# Altium schematic sheet QI9-2604-A01.SchDoc
size D; SheetNumber: 1; SheetTotal: 1
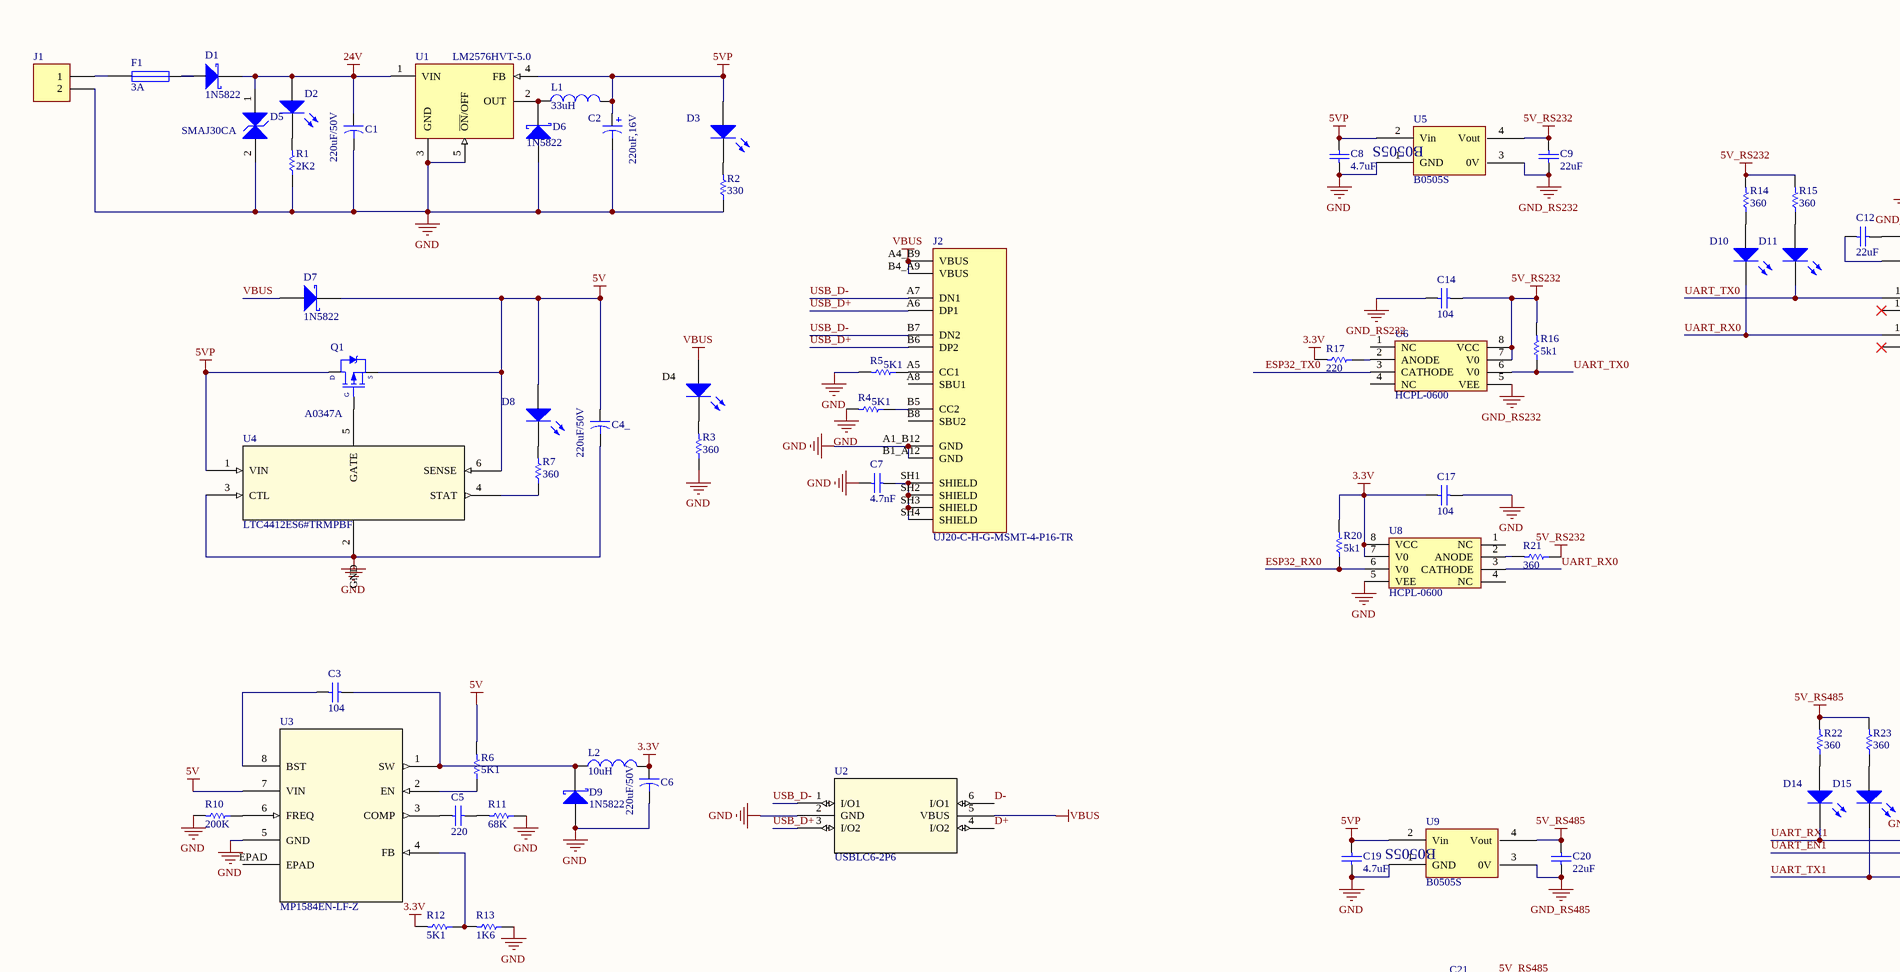
[diagram p0: QI9-2604-A01.SchDoc, top left]
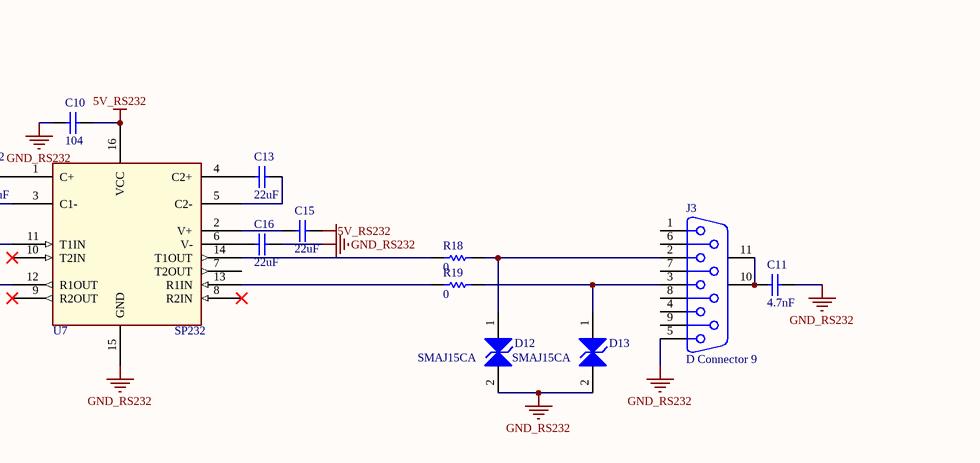
[diagram p1: QI9-2604-A01.SchDoc, top right]
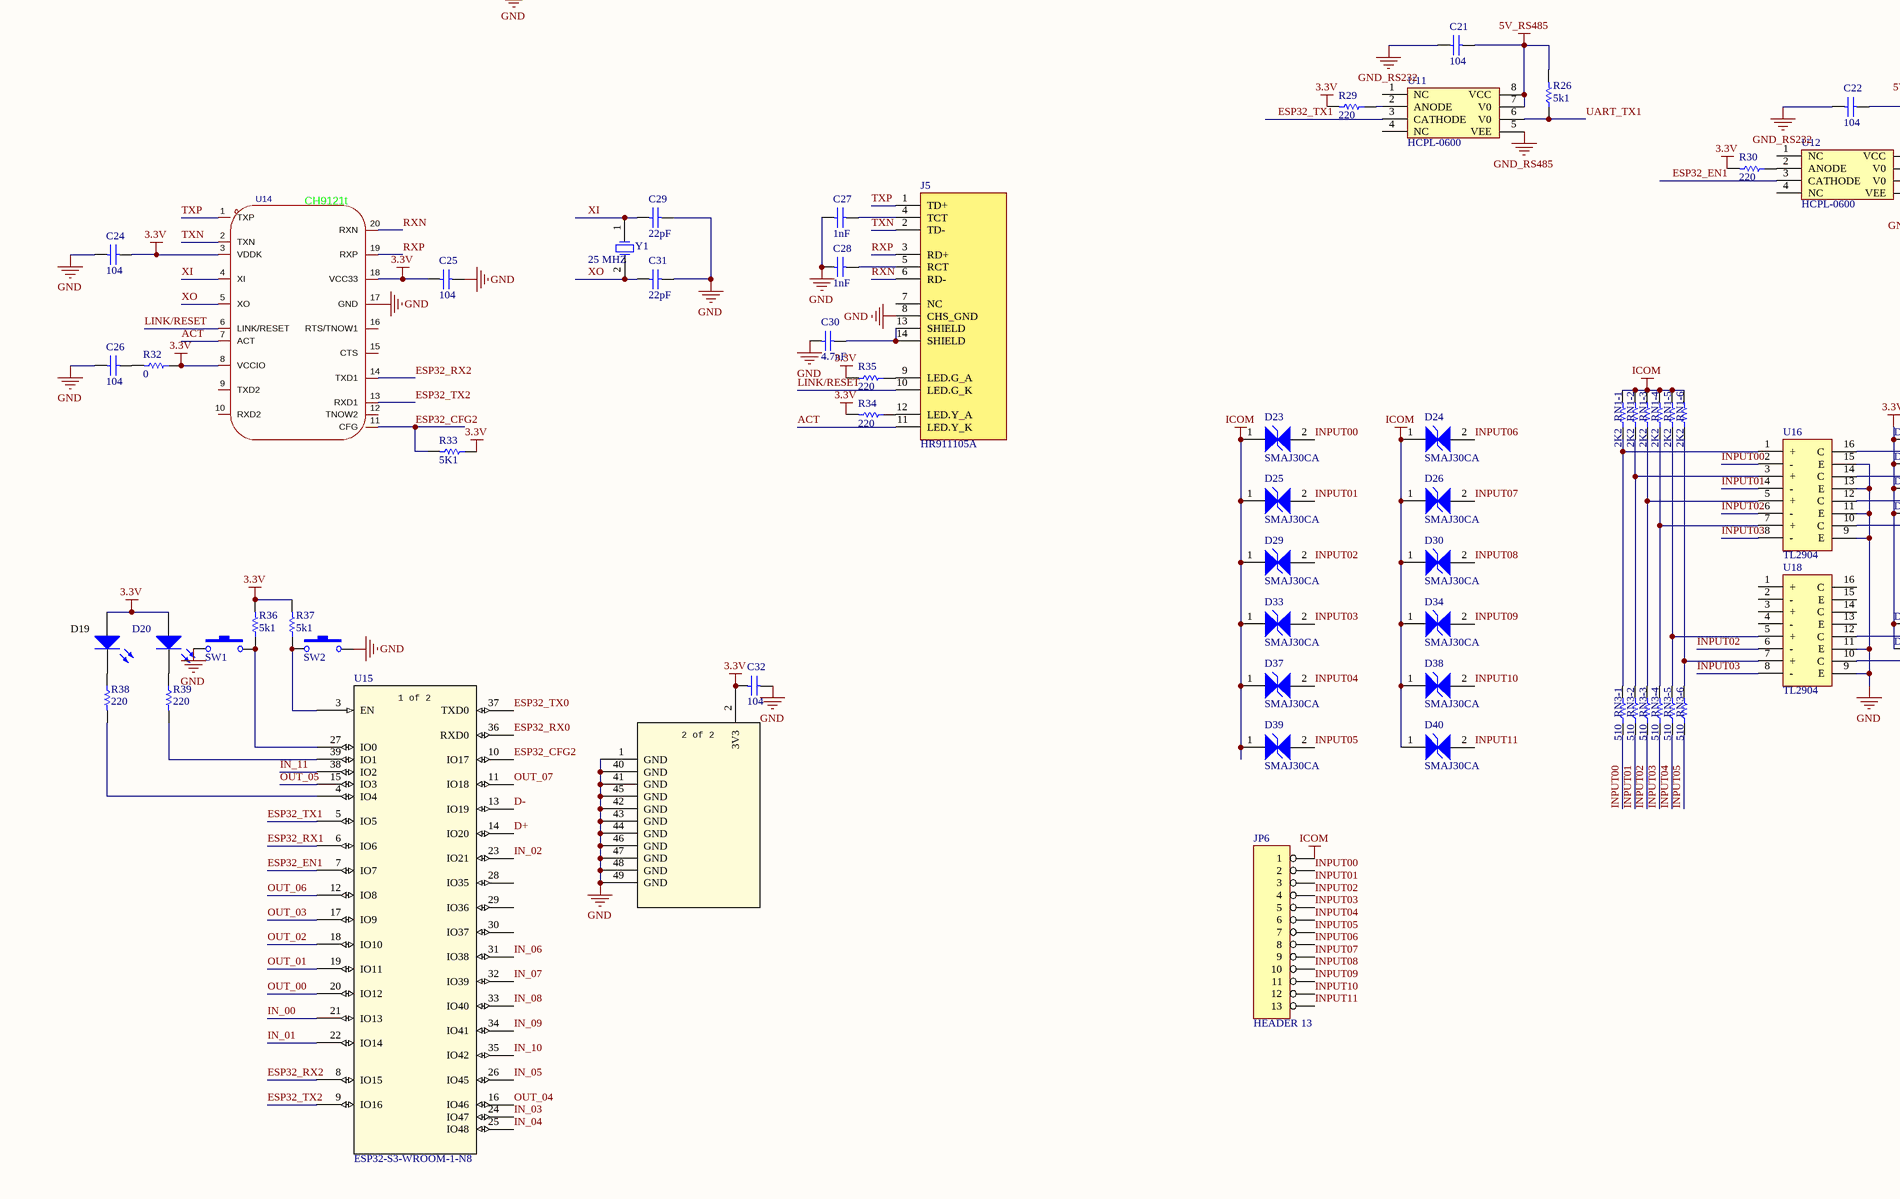
[diagram p2: QI9-2604-A01.SchDoc, bottom left]
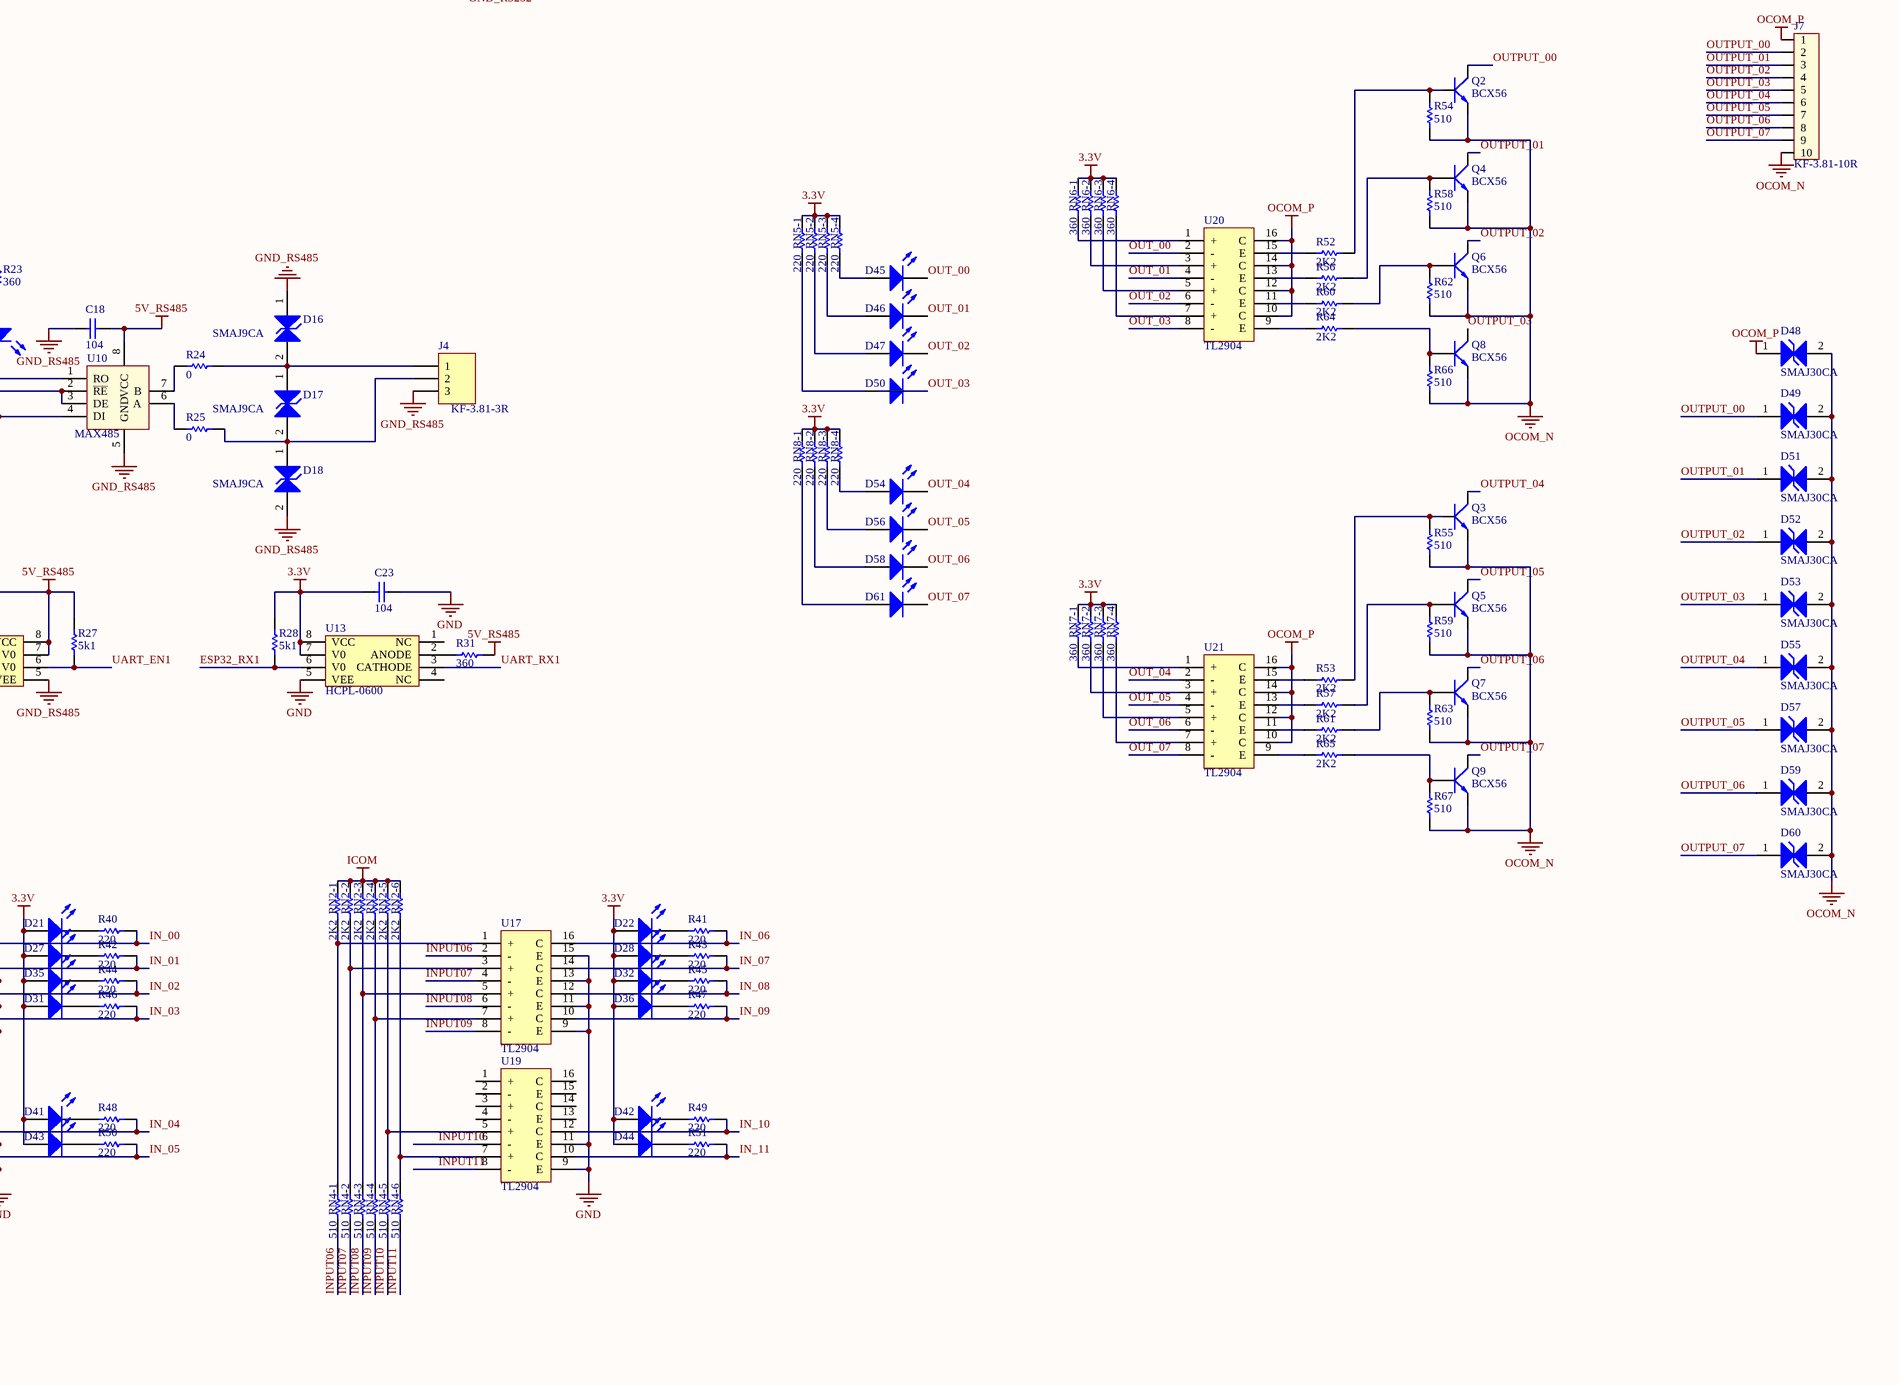
[diagram p3: QI9-2604-A01.SchDoc, bottom right]

## Parts
C1  value 220uF/50V  [C2]  (hidden comment: Cap2)
C2  value 220uF,16V  [c3]
C3  value 104  [0805]  (hidden comment: Cap)
C4_  value 220uF/50V  [C2]  (hidden comment: Cap2)
C5  value 220  [0805]  (hidden comment: Cap)
C6  value 220uF/50V  [C2]  (hidden comment: Cap2)
C7  value 4.7nF  [0805]  (hidden comment: Cap)
C8  value 4.7uF  [0805]  (hidden comment: Cap)
C9  value 22uF  [0805]  (hidden comment: Cap)
C10  value 104  [0805]  (hidden comment: Cap)
C11  value 4.7nF  [0805]  (hidden comment: Cap)
C12  value 22uF  [0805]  (hidden comment: Cap)
C13  value 22uF  [0805]  (hidden comment: Cap)
C14  value 104  [0805]  (hidden comment: Cap)
C15  value 22uF  [0805]  (hidden comment: Cap)
C16  value 22uF  [0805]  (hidden comment: Cap)
C17  value 104  [0805]  (hidden comment: Cap)
C18  value 104  [0805]  (hidden comment: Cap)
C19  value 4.7uF  [0805]  (hidden comment: Cap)
C20  value 22uF  [0805]  (hidden comment: Cap)
C21  value 104  [0805]  (hidden comment: Cap)
C22  value 104  [0805]  (hidden comment: Cap)
C23  value 104  [0805]  (hidden comment: Cap)
C24  value 104  [0805]  (hidden comment: Cap)
C25  value 104  [0805]  (hidden comment: Cap)
C26  value 104  [0805]  (hidden comment: Cap)
C27  value 1nF  [0805]  (hidden comment: Cap)
C28  value 1nF  [0805]  (hidden comment: Cap)
C29  value 22pF  [0805]  (hidden comment: Cap)
C30  value 4.7nF  [0805]  (hidden comment: Cap)
C31  value 22pF  [0805]  (hidden comment: Cap)
C32  value 104  [0805]  (hidden comment: Cap)
D1  1N5822  [DIODE_DO214AC_SMA]
D2  LED  [LED_0805_RED]  (value not drawn)
D3  LED  [LED_0805_RED]  (value not drawn)
D4  LED  [LED_0805_RED]  (value not drawn)
D5  SMAJ30CA  [SMA_STM]
D6  1N5822  [DIODE_DO214AC_SMA]
D7  1N5822  [DIODE_DO214AC_SMA]
D8  LED  [LED_0805_RED]  (value not drawn)
D9  1N5822  [DIODE_DO214AC_SMA]
D10  LED  [LED_0805_RED]  (value not drawn)
D11  LED  [LED_0805_RED]  (value not drawn)
D12  SMAJ15CA  [SMA_STM]
D13  SMAJ15CA  [SMA_STM]
D14  LED  [LED_0805_RED]  (value not drawn)
D15  LED  [LED_0805_RED]  (value not drawn)
D16  SMAJ9CA  [SMA_STM]
D17  SMAJ9CA  [SMA_STM]
D18  SMAJ9CA  [SMA_STM]
D19  LED  [LED_0805_RED]  (value not drawn)
D20  LED  [LED_0805_RED]  (value not drawn)
D21  LED  [LED_0805_RED]  (value not drawn)
D22  LED  [LED_0805_RED]  (value not drawn)
D23  SMAJ30CA  [SMA_STM]
D24  SMAJ30CA  [SMA_STM]
D25  SMAJ30CA  [SMA_STM]
D26  SMAJ30CA  [SMA_STM]
D27  LED  [LED_0805_RED]  (value not drawn)
D28  LED  [LED_0805_RED]  (value not drawn)
D29  SMAJ30CA  [SMA_STM]
D30  SMAJ30CA  [SMA_STM]
D31  LED  [LED_0805_RED]  (value not drawn)
D32  LED  [LED_0805_RED]  (value not drawn)
D33  SMAJ30CA  [SMA_STM]
D34  SMAJ30CA  [SMA_STM]
D35  LED  [LED_0805_RED]  (value not drawn)
D36  LED  [LED_0805_RED]  (value not drawn)
D37  SMAJ30CA  [SMA_STM]
D38  SMAJ30CA  [SMA_STM]
D39  SMAJ30CA  [SMA_STM]
D40  SMAJ30CA  [SMA_STM]
D41  LED  [LED_0805_RED]  (value not drawn)
D42  LED  [LED_0805_RED]  (value not drawn)
D43  LED  [LED_0805_RED]  (value not drawn)
D44  LED  [LED_0805_RED]  (value not drawn)
D45  LED  [LED_0805_RED]  (value not drawn)
D46  LED  [LED_0805_RED]  (value not drawn)
D47  LED  [LED_0805_RED]  (value not drawn)
D48  SMAJ30CA  [SMA_STM]
D49  SMAJ30CA  [SMA_STM]
D50  LED  [LED_0805_RED]  (value not drawn)
D51  SMAJ30CA  [SMA_STM]
D52  SMAJ30CA  [SMA_STM]
D53  SMAJ30CA  [SMA_STM]
D54  LED  [LED_0805_RED]  (value not drawn)
D55  SMAJ30CA  [SMA_STM]
D56  LED  [LED_0805_RED]  (value not drawn)
D57  SMAJ30CA  [SMA_STM]
D58  LED  [LED_0805_RED]  (value not drawn)
D59  SMAJ30CA  [SMA_STM]
D60  SMAJ30CA  [SMA_STM]
D61  LED  [LED_0805_RED]  (value not drawn)
F1  3A  [FUSE_1812(4532)]
J1  KF-3.810-2R  [KF2-3.81]  (value not drawn)
J2  UJ20-C-H-G-MSMT-4-P16-TR  [UJ20-C-H-G-MSMT-4-P16-TR]
J3  D Connector 9  [DSUB1.385-2H9]
J4  KF-3.81-3R  [KF3-3.81]
J5  HR911105A  [HR911105A]
J7  KF-3.81-10R  [KF10-3.81]
JP6  HEADER 13  [kf13-3.81]
L1  value 33uH  [L1A]  (hidden comment: Inductor)
L2  value 10uH  [L1A]  (hidden comment: Inductor)
Q1  A0347A  [SOT23_]
Q2  BCX56  [SOT89]
Q3  BCX56  [SOT89]
Q4  BCX56  [SOT89]
Q5  BCX56  [SOT89]
Q6  BCX56  [SOT89]
Q7  BCX56  [SOT89]
Q8  BCX56  [SOT89]
Q9  BCX56  [SOT89]
R1  value 2K2  [SM-RES-0805]  (hidden comment: Res1)
R2  value 330  [SM-RES-0805]  (hidden comment: Res1)
R3  value 360  [SM-RES-0805]  (hidden comment: Res1)
R4  value 5K1  [SM-RES-0805]  (hidden comment: Res1)
R5  value 5K1  [SM-RES-0805]  (hidden comment: Res1)
R6  value 5K1  [SM-RES-0805]  (hidden comment: Res1)
R7  value 360  [SM-RES-0805]  (hidden comment: Res1)
R10  value 200K  [SM-RES-0805]  (hidden comment: Res1)
R11  value 68K  [SM-RES-0805]  (hidden comment: Res1)
R12  value 5K1  [SM-RES-0805]  (hidden comment: Res1)
R13  value 1K6  [SM-RES-0805]  (hidden comment: Res1)
R14  value 360  [SM-RES-0805]  (hidden comment: Res1)
R15  value 360  [SM-RES-0805]  (hidden comment: Res1)
R16  value 5k1  [SM-RES-0805]  (hidden comment: Res1)
R17  value 220  [SM-RES-0805]  (hidden comment: Res1)
R18  value 0  [SM-RES-0805]  (hidden comment: Res1)
R19  value 0  [SM-RES-0805]  (hidden comment: Res1)
R20  value 5k1  [SM-RES-0805]  (hidden comment: Res1)
R21  value 360  [SM-RES-0805]  (hidden comment: Res1)
R22  value 360  [SM-RES-0805]  (hidden comment: Res1)
R23  value 360  [SM-RES-0805]  (hidden comment: Res1)
R24  value 0  [SM-RES-0805]  (hidden comment: Res1)
R25  value 0  [SM-RES-0805]  (hidden comment: Res1)
R26  value 5k1  [SM-RES-0805]  (hidden comment: Res1)
R27  value 5k1  [SM-RES-0805]  (hidden comment: Res1)
R28  value 5k1  [SM-RES-0805]  (hidden comment: Res1)
R29  value 220  [SM-RES-0805]  (hidden comment: Res1)
R30  value 220  [SM-RES-0805]  (hidden comment: Res1)
R31  value 360  [SM-RES-0805]  (hidden comment: Res1)
R32  value 0  [SM-RES-0805]  (hidden comment: Res1)
R33  value 5K1  [SM-RES-0805]  (hidden comment: Res1)
R34  value 220  [SM-RES-0805]  (hidden comment: Res1)
R35  value 220  [SM-RES-0805]  (hidden comment: Res1)
R36  value 5k1  [SM-RES-0805]  (hidden comment: Res1)
R37  value 5k1  [SM-RES-0805]  (hidden comment: Res1)
R38  value 220  [SM-RES-0805]  (hidden comment: Res1)
R39  value 220  [SM-RES-0805]  (hidden comment: Res1)
R40  value 220  [SM-RES-0805]  (hidden comment: Res1)
R41  value 220  [SM-RES-0805]  (hidden comment: Res1)
R42  value 220  [SM-RES-0805]  (hidden comment: Res1)
R43  value 220  [SM-RES-0805]  (hidden comment: Res1)
R44  value 220  [SM-RES-0805]  (hidden comment: Res1)
R45  value 220  [SM-RES-0805]  (hidden comment: Res1)
R46  value 220  [SM-RES-0805]  (hidden comment: Res1)
R47  value 220  [SM-RES-0805]  (hidden comment: Res1)
R48  value 220  [SM-RES-0805]  (hidden comment: Res1)
R49  value 220  [SM-RES-0805]  (hidden comment: Res1)
R50  value 220  [SM-RES-0805]  (hidden comment: Res1)
R51  value 220  [SM-RES-0805]  (hidden comment: Res1)
R52  value 2K2  [SM-RES-0805]  (hidden comment: Res1)
R53  value 2K2  [SM-RES-0805]  (hidden comment: Res1)
R54  value 510  [SM-RES-0805]  (hidden comment: Res1)
R55  value 510  [SM-RES-0805]  (hidden comment: Res1)
R56  value 2K2  [SM-RES-0805]  (hidden comment: Res1)
R57  value 2K2  [SM-RES-0805]  (hidden comment: Res1)
R58  value 510  [SM-RES-0805]  (hidden comment: Res1)
R59  value 510  [SM-RES-0805]  (hidden comment: Res1)
R60  value 2K2  [SM-RES-0805]  (hidden comment: Res1)
R61  value 2K2  [SM-RES-0805]  (hidden comment: Res1)
R62  value 510  [SM-RES-0805]  (hidden comment: Res1)
R63  value 510  [SM-RES-0805]  (hidden comment: Res1)
R64  value 2K2  [SM-RES-0805]  (hidden comment: Res1)
R65  value 2K2  [SM-RES-0805]  (hidden comment: Res1)
R66  value 510  [SM-RES-0805]  (hidden comment: Res1)
R67  value 510  [SM-RES-0805]  (hidden comment: Res1)
RN1-1  value 2K2  [SM-RES-0805]  (hidden comment: Res1)
RN1-2  value 2K2  [SM-RES-0805]  (hidden comment: Res1)
RN1-3  value 2K2  [SM-RES-0805]  (hidden comment: Res1)
RN1-4  value 2K2  [SM-RES-0805]  (hidden comment: Res1)
RN1-5  value 2K2  [SM-RES-0805]  (hidden comment: Res1)
RN1-6  value 2K2  [SM-RES-0805]  (hidden comment: Res1)
RN2-1  value 2K2  [SM-RES-0805]  (hidden comment: Res1)
RN2-2  value 2K2  [SM-RES-0805]  (hidden comment: Res1)
RN2-3  value 2K2  [SM-RES-0805]  (hidden comment: Res1)
RN2-4  value 2K2  [SM-RES-0805]  (hidden comment: Res1)
RN2-5  value 2K2  [SM-RES-0805]  (hidden comment: Res1)
RN2-6  value 2K2  [SM-RES-0805]  (hidden comment: Res1)
RN3-1  value 510  [SM-RES-0805]  (hidden comment: Res1)
RN3-2  value 510  [SM-RES-0805]  (hidden comment: Res1)
RN3-3  value 510  [SM-RES-0805]  (hidden comment: Res1)
RN3-4  value 510  [SM-RES-0805]  (hidden comment: Res1)
RN3-5  value 510  [SM-RES-0805]  (hidden comment: Res1)
RN3-6  value 510  [SM-RES-0805]  (hidden comment: Res1)
RN4-1  value 510  [SM-RES-0805]  (hidden comment: Res1)
RN4-2  value 510  [SM-RES-0805]  (hidden comment: Res1)
RN4-3  value 510  [SM-RES-0805]  (hidden comment: Res1)
RN4-4  value 510  [SM-RES-0805]  (hidden comment: Res1)
RN4-5  value 510  [SM-RES-0805]  (hidden comment: Res1)
RN4-6  value 510  [SM-RES-0805]  (hidden comment: Res1)
RN5-1  value 220  [SM-RES-0805]  (hidden comment: Res1)
RN5-2  value 220  [SM-RES-0805]  (hidden comment: Res1)
RN5-3  value 220  [SM-RES-0805]  (hidden comment: Res1)
RN5-4  value 220  [SM-RES-0805]  (hidden comment: Res1)
RN6-1  value 360  [SM-RES-0805]  (hidden comment: Res1)
RN6-2  value 360  [SM-RES-0805]  (hidden comment: Res1)
RN6-3  value 360  [SM-RES-0805]  (hidden comment: Res1)
RN6-4  value 360  [SM-RES-0805]  (hidden comment: Res1)
RN7-1  value 360  [SM-RES-0805]  (hidden comment: Res1)
RN7-2  value 360  [SM-RES-0805]  (hidden comment: Res1)
RN7-3  value 360  [SM-RES-0805]  (hidden comment: Res1)
RN7-4  value 360  [SM-RES-0805]  (hidden comment: Res1)
RN8-1  value 220  [SM-RES-0805]  (hidden comment: Res1)
RN8-2  value 220  [SM-RES-0805]  (hidden comment: Res1)
RN8-3  value 220  [SM-RES-0805]  (hidden comment: Res1)
RN8-4  value 220  [SM-RES-0805]  (hidden comment: Res1)
SW1  SW-SMD  [SW-SMD]  (value not drawn)
SW2  SW-SMD  [SW-SMD]  (value not drawn)
U1  LM2576HVT-5.0  [T05]
U2  USBLC6-2P6  [SOT-666_STM]
U3  MP1584EN-LF-Z  [SOIC8E_MPS]
U4  LTC4412ES6#TRMPBF  [SOT-6_S_LIT]
U5  B0505S  [B0505S]
U6  HCPL-0600  [SOIC8_50_328_25X90_SMT]
U7  SP232  [soic16_m]
U8  HCPL-0600  [SOIC8_50_328_25X90_SMT]
U9  B0505S  [B0505S]
U10  MAX485  [DIP8]
U11  HCPL-0600  [SOIC8_50_328_25X90_SMT]
U12  HCPL-0600  [SOIC8_50_328_25X90_SMT]
U13  HCPL-0600  [SOIC8_50_328_25X90_SMT]
U14  CH9121t  [tssop20]
U15  ESP32-S3-WROOM-1-N8  [ESP32-S3-WROOM-1_EXP]
U16  TL2904  [SOP16]
U17  TL2904  [SOP16]
U18  TL2904  [SOP16]
U19  TL2904  [SOP16]
U20  TL2904  [SOP16]
U21  TL2904  [SOP16]
Y1  25 MHZ  [CRYSTAL]

## Nets
3.3V: C6.1 C17.1 C23.1 C24.2 C25.1 C32.1 D19.1(A) D20.1(A) D21.1(A) D22.1(A) D27.1(A) D28.1(A) D31.1(A) D32.1(A) D35.1(A) D36.1(A) D41.1(A) D42.1(A) D43.1(A) D44.1(A) L2.2 R12.2 R17.2 R20.2 R28.2 R29.2 R30.2 R32.1 R33.1 R34.2 R35.2 R36.2 R37.2 RN5-1.2 RN5-2.2 RN5-3.2 RN5-4.2 RN6-1.2 RN6-2.2 RN6-3.2 RN6-4.2 RN7-1.2 RN7-2.2 RN7-3.2 RN7-4.2 RN8-1.2 RN8-2.2 RN8-3.2 RN8-4.2 U8.7(V0) U8.8(VCC) U13.7(V0) U13.8(VCC) U14.3(VDDK) U14.8(VCCIO) U14.18(VCC33) U15.2(3V3)
5V: C4_.1 D7.2(K) D8.1(A) Q1.3(S) R6.2 U3.7(VIN) U4.6(SENSE)
5V_RS232: C9.2 C10.2 C14.2 C15.2 R14.2 R15.2 R16.2 R21.1 U5.4(Vout) U6.7(V0) U6.8(VCC) U7.16(VCC)
5V_RS485: C18.2 C20.2 C21.2 C22.2 R22.2 R23.2 R26.2 R27.2 R31.1 U9.4(Vout) U10.8(VCC) U11.7(V0) U11.8(VCC) U12.7(V0) U12.8(VCC)
5VP: C2.1 C8.1 C19.1 D3.1(A) L1.2 Q1.2(D) U1.4(FB) U4.1(VIN) U5.2(Vin) U9.2(Vin)
24V: C1.1 D1.2(K) D2.1(A) D5.1(A) U1.1(VIN)
GND: C1.2 C2.2 C4_.2 C6.2 C7.1 C8.2 C17.2 C19.2 C23.2 C24.1 C25.2 C26.1 C27.1 C28.1 C29.2 C30.1 C31.2 C32.2 D5.2(K) D6.1(A) D9.1(A) J1.2 J2.A1_B12(GND) J2.B1_A12(GND) J5.8(CHS_GND) R1.1 R2.1 R3.1 R4.2 R5.2 R10.2 R11.1 R13.1 SW1.1 SW2.2 U1.3(GND) U1.5(~{ON}/OFF) U2.2(GND) U3.5(GND) U4.3(CTL) U5.1(GND) U8.5(VEE) U9.1(GND) U13.5(VEE) U14.17(GND) U15.1(GND) U15.40(GND) U15.41(GND) U15.42(GND) U15.43(GND) U15.44(GND) U15.45(GND) U15.46(GND) U15.47(GND) U15.48(GND) U15.49(GND) U16.9(E) U16.11(E) U16.13(E) U16.15(E) U17.9(E) U17.11(E) U17.13(E) U17.15(E) U18.9(E) U18.11(E) U19.9(E) U19.11(E)
GND_RS232: C9.1 C10.1 C11.2 C14.1 C16.1 C21.1 C22.1 D12.2(K) D13.2(K) J3.5 U5.3(0V) U6.5(VEE) U7.15(GND)
GND_RS485: C18.1 C20.1 D16.1(A) D18.2(K) J4.3 U9.3(0V) U10.5(GND) U11.5(VEE) U12.5(VEE)
ICOM: D23.1(A) D24.1(A) D25.1(A) D26.1(A) D29.1(A) D30.1(A) D33.1(A) D34.1(A) D37.1(A) D38.1(A) D39.1(A) D40.1(A) JP6.1 RN1-1.2 RN1-2.2 RN1-3.2 RN1-4.2 RN1-5.2 RN1-6.2 RN2-1.2 RN2-2.2 RN2-3.2 RN2-4.2 RN2-5.2 RN2-6.2
OCOM_N: D48.2(K) D49.2(K) D51.2(K) D52.2(K) D53.2(K) D55.2(K) D57.2(K) D59.2(K) D60.2(K) J7.10 Q2.2(E) Q3.2(E) Q4.2(E) Q5.2(E) Q6.2(E) Q7.2(E) Q8.2(E) Q9.2(E) R54.1 R55.1 R58.1 R59.1 R62.1 R63.1 R66.1 R67.1
OCOM_P: D48.1(A) J7.1 U20.10(C) U20.12(C) U20.14(C) U20.16(C) U21.10(C) U21.12(C) U21.14(C) U21.16(C)
VBUS: D4.1(A) D7.1(A) J2.A4_B9(VBUS) J2.B4_A9(VBUS) U2.5(VBUS)
ACT: J5.11(LED.Y_K) U14.7(ACT)
D+: U2.4(I/O2) U15.14(IO20)
D-: U2.6(I/O1) U15.13(IO19)
ESP32_CFG2: R33.2 U14.11(CFG) U15.10(IO17)
ESP32_EN1: U12.3(CATHODE) U15.7(IO7)
ESP32_RX0: R20.1 U8.6(V0) U15.36(RXD0)
ESP32_RX1: R28.1 U13.6(V0) U15.6(IO6)
ESP32_RX2: U14.14(TXD1) U15.8(IO15)
ESP32_TX0: U6.3(CATHODE) U15.37(TXD0)
ESP32_TX1: U11.3(CATHODE) U15.5(IO5)
ESP32_TX2: U14.13(RXD1) U15.9(IO16)
IN_00: R40.2 U15.21(IO13) U16.16(C)
IN_01: R42.2 U15.22(IO14) U16.14(C)
IN_02: R44.2 U15.23(IO21) U16.12(C)
IN_03: R46.2 U15.24(IO47) U16.10(C)
IN_04: R48.2 U15.25(IO48) U18.12(C)
IN_05: R50.2 U15.26(IO45) U18.10(C)
IN_06: R41.2 U15.31(IO38) U17.16(C)
IN_07: R43.2 U15.32(IO39) U17.14(C)
IN_08: R45.2 U15.33(IO40) U17.12(C)
IN_09: R47.2 U15.34(IO41) U17.10(C)
IN_10: R49.2 U15.35(IO42) U19.12(C)
IN_11: R51.2 U15.38(IO2) U19.10(C)
INPUT00: D23.2(K) JP6.2 RN3-1.1 U16.2(-)
INPUT01: D25.2(K) JP6.3 RN3-2.1 U16.4(-)
INPUT02: D29.2(K) JP6.4 RN3-3.1 U16.6(-) U18.6(-)
INPUT03: D33.2(K) JP6.5 RN3-4.1 U16.8(-) U18.8(-)
INPUT04: D37.2(K) JP6.6 RN3-5.1
INPUT05: D39.2(K) JP6.7 RN3-6.1
INPUT06: D24.2(K) JP6.8 RN4-1.1 U17.2(-)
INPUT07: D26.2(K) JP6.9 RN4-2.1 U17.4(-)
INPUT08: D30.2(K) JP6.10 RN4-3.1 U17.6(-)
INPUT09: D34.2(K) JP6.11 RN4-4.1 U17.8(-)
INPUT10: D38.2(K) JP6.12 RN4-5.1 U19.6(-)
INPUT11: D40.2(K) JP6.13 RN4-6.1 U19.8(-)
LINK/RESET: J5.10(LED.G_K) U14.6(LINK/RESET)
OUT_00: D45.2(K) U15.20(IO12) U20.2(-)
OUT_01: D46.2(K) U15.19(IO11) U20.4(-)
OUT_02: D47.2(K) U15.18(IO10) U20.6(-)
OUT_03: D50.2(K) U15.17(IO9) U20.8(-)
OUT_04: D54.2(K) U15.16(IO46) U21.2(-)
OUT_05: D56.2(K) U15.15(IO3) U21.4(-)
OUT_06: D58.2(K) U15.12(IO8) U21.6(-)
OUT_07: D61.2(K) U15.11(IO18) U21.8(-)
OUTPUT_00: D49.1(A) J7.2 Q2.3(C)
OUTPUT_01: D51.1(A) J7.3 Q4.3(C)
OUTPUT_02: D52.1(A) J7.4 Q6.3(C)
OUTPUT_03: D53.1(A) J7.5 Q8.3(C)
OUTPUT_04: D55.1(A) J7.6 Q3.3(C)
OUTPUT_05: D57.1(A) J7.7 Q5.3(C)
OUTPUT_06: D59.1(A) J7.8 Q7.3(C)
OUTPUT_07: D60.1(A) J7.9 Q9.3(C)
RXN: J5.6(RD-) U14.20(RXN)
RXP: J5.3(RD+) U14.19(RXP)
TXN: J5.2(TD-) U14.2(TXN)
TXP: J5.1(TD+) U14.1(TXP)
UART_EN1: R27.1 U10.2(~{RE}) U10.3(DE) U12.6(V0)
UART_RX0: D10.2(K) U7.12(R1OUT) U8.3(CATHODE)
UART_RX1: D14.2(K) U10.1(RO) U13.3(CATHODE)
UART_TX0: D11.2(K) R16.1 U6.6(V0) U7.11(T1IN)
UART_TX1: D15.2(K) R26.1 U10.4(DI) U11.6(V0)
USB_D+: J2.A6(DP1) J2.B6(DP2) U2.3(I/O2)
USB_D-: J2.A7(DN1) J2.B7(DN2) U2.1(I/O1)
XI: C29.1 U14.4(XI) Y1.1(OSC1)
XO: C31.1 U14.5(XO) Y1.2(OSC2)
NetC3_1: C3.1 U3.8(BST)
NetC3_2: C3.2 D9.2(K) L2.1 U3.1(SW)
NetC5_1: C5.1 U3.3(COMP)
NetC5_2: C5.2 R11.2
NetC7_2: C7.2 J2.SH1(SHIELD) J2.SH2(SHIELD) J2.SH3(SHIELD) J2.SH4(SHIELD)
NetC11_1: C11.1 J3.10(MH1) J3.11(MH2)
NetC12_1: C12.1 U7.3(C1-)
NetC12_2: C12.2 U7.1(C+)
NetC13_1: C13.1 U7.4(C2+)
NetC13_2: C13.2 U7.5(C2-)
NetC15_1: C15.1 U7.2(V+)
NetC16_2: C16.2 U7.6(V-)
NetC26_2: C26.2 R32.2
NetC27_2: C27.2 J5.4(TCT)
NetC28_2: C28.2 J5.5(RCT)
NetC30_2: C30.2 J5.13(SHIELD) J5.14(SHIELD)
NetD1_1: D1.1(A) F1.2
NetD2_2: D2.2(K) R1.2
NetD3_2: D3.2(K) R2.2
NetD4_2: D4.2(K) R3.2
NetD6_2: D6.2(K) L1.1 U1.2(OUT)
NetD8_2: D8.2(K) R7.2
NetD10_1: D10.1(A) R14.1
NetD11_1: D11.1(A) R15.1
NetD12_1: D12.1(A) J3.2 R18.1
NetD13_1: D13.1(A) J3.3 R19.1
NetD14_1: D14.1(A) R22.1
NetD15_1: D15.1(A) R23.1
NetD16_2: D16.2(K) D17.1(A) J4.1 R24.1
NetD17_2: D17.2(K) D18.1(A) J4.2 R25.1
NetD19_2: D19.2(K) R38.1
NetD20_2: D20.2(K) R39.1
NetD21_2: D21.2(K) R40.1
NetD22_2: D22.2(K) R41.1
NetD27_2: D27.2(K) R42.1
NetD28_2: D28.2(K) R43.1
NetD31_2: D31.2(K) R46.1
NetD32_2: D32.2(K) R45.1
NetD35_2: D35.2(K) R44.1
NetD36_2: D36.2(K) R47.1
NetD41_2: D41.2(K) R48.1
NetD42_2: D42.2(K) R49.1
NetD43_2: D43.2(K) R50.1
NetD44_2: D44.2(K) R51.1
NetD45_1: D45.1(A) RN5-4.1
NetD46_1: D46.1(A) RN5-3.1
NetD47_1: D47.1(A) RN5-2.1
NetD50_1: D50.1(A) RN5-1.1
NetD54_1: D54.1(A) RN8-4.1
NetD56_1: D56.1(A) RN8-3.1
NetD58_1: D58.1(A) RN8-2.1
NetD61_1: D61.1(A) RN8-1.1
NetF1_1: F1.1 J1.1
NetJ2_A5: J2.A5(CC1) R5.1
NetJ2_B5: J2.B5(CC2) R4.1
NetJ5_9: J5.9(LED.G_A) R35.1
NetJ5_12: J5.12(LED.Y_A) R34.1
NetQ1_1: Q1.1(G) U4.5(GATE)
NetQ2_1: Q2.1(B) R52.2 R54.2
NetQ3_1: Q3.1(B) R53.2 R55.2
NetQ4_1: Q4.1(B) R56.2 R58.2
NetQ5_1: Q5.1(B) R57.2 R59.2
NetQ6_1: Q6.1(B) R60.2 R62.2
NetQ7_1: Q7.1(B) R61.2 R63.2
NetQ8_1: Q8.1(B) R64.2 R66.2
NetQ9_1: Q9.1(B) R65.2 R67.2
NetR6_1: R6.1 U3.2(EN)
NetR7_1: R7.1 U4.4(STAT)
NetR10_1: R10.1 U3.6(FREQ)
NetR12_1: R12.1 R13.2 U3.4(FB)
NetR17_1: R17.1 U6.2(ANODE)
NetR18_2: R18.2 U7.14(T1OUT)
NetR19_2: R19.2 U7.13(R1IN)
NetR21_2: R21.2 U8.2(ANODE)
NetR24_2: R24.2 U10.7(B)
NetR25_2: R25.2 U10.6(A)
NetR29_1: R29.1 U11.2(ANODE)
NetR30_1: R30.1 U12.2(ANODE)
NetR31_2: R31.2 U13.2(ANODE)
NetR36_1: R36.1 SW1.2 U15.27(IO0)
NetR37_1: R37.1 SW2.1 U15.3(EN)
NetR38_2: R38.2 U15.4(IO4)
NetR39_2: R39.2 U15.39(IO1)
NetR52_1: R52.1 U20.15(E)
NetR53_1: R53.1 U21.15(E)
NetR56_1: R56.1 U20.13(E)
NetR57_1: R57.1 U21.13(E)
NetR60_1: R60.1 U20.11(E)
NetR61_1: R61.1 U21.11(E)
NetR64_1: R64.1 U20.9(E)
NetR65_1: R65.1 U21.9(E)
NetRN1-1_1: RN1-1.1 RN3-1.2 U16.1(+)
NetRN1-2_1: RN1-2.1 RN3-2.2 U16.3(+)
NetRN1-3_1: RN1-3.1 RN3-3.2 U16.5(+)
NetRN1-4_1: RN1-4.1 RN3-4.2 U16.7(+)
NetRN1-5_1: RN1-5.1 RN3-5.2 U18.5(+)
NetRN1-6_1: RN1-6.1 RN3-6.2 U18.7(+)
NetRN2-1_1: RN2-1.1 RN4-1.2 U17.1(+)
NetRN2-2_1: RN2-2.1 RN4-2.2 U17.3(+)
NetRN2-3_1: RN2-3.1 RN4-3.2 U17.5(+)
NetRN2-4_1: RN2-4.1 RN4-4.2 U17.7(+)
NetRN2-5_1: RN2-5.1 RN4-5.2 U19.5(+)
NetRN2-6_1: RN2-6.1 RN4-6.2 U19.7(+)
NetRN6-1_1: RN6-1.1 U20.1(+)
NetRN6-2_1: RN6-2.1 U20.3(+)
NetRN6-3_1: RN6-3.1 U20.5(+)
NetRN6-4_1: RN6-4.1 U20.7(+)
NetRN7-1_1: RN7-1.1 U21.1(+)
NetRN7-2_1: RN7-2.1 U21.3(+)
NetRN7-3_1: RN7-3.1 U21.5(+)
NetRN7-4_1: RN7-4.1 U21.7(+)

Not connected (* = marked no-connect by the designer): J2 A8(SBU1) B8(SBU2); J3 1 4 6 7 8 9; J5 7(NC); U3 EPAD; U4 2(GND); U6 1(NC) 4(NC); U7 7(T2OUT) 8(R2IN)* 9(R2OUT)* 10(T2IN)*; U8 1(NC) 4(NC); U11 1(NC) 4(NC); U12 1(NC) 4(NC); U13 1(NC) 4(NC); U14 9(TXD2) 10(RXD2) 12(TNOW2) 15(CTS) 16(RTS/TNOW1); U15 28(IO35) 29(IO36) 30(IO37); U18 1(+) 2(-) 3(+) 4(-) 13(E) 14(C) 15(E) 16(C); U19 1(+) 2(-) 3(+) 4(-) 13(E) 14(C) 15(E) 16(C)

## Notes on the sheet
- (in symbol ESP32-S3-WROOM-1) 1 of 2; 2 of 2

## Library data of the parts
C1 C4_ C6 = Cap2: Capacitor; Published: 23-Sep-2002; PackageReference: CAPR5-4X5; Publisher: Altium Limited
C2 = Cap Pol 3mm: Polarized Capacitor (Axial); Published: 8-Jun-2000; LatestRevisionDate: 17-Jul-2002; LatestRevisionNote: Re-released for DXP Platform.; PackageReference: POLAR0.8; Publisher: Altium Limited
C3 C5 C7-C32 = Cap: Capacitor; Published: 8-Jun-2000; LatestRevisionDate: 17-Jul-2002; LatestRevisionNote: Re-released for DXP Platform.; PackageReference: RAD-0.3; Publisher: Altium Limited
D1 D6 D7 D9 = D Schottky: Schottky Diode; Published: 8-Jun-2000; LatestRevisionDate: 17-Jul-2002; LatestRevisionNote: Re-released for DXP Platform.; PackageReference: SMB; Publisher: Altium Limited; Code_JEDEC: DO-214-AA
D2-D4 D8 D10 D11 D14 D15 D19-D22 D27 D28 D31 D32 D35 D36 D41-D47 D50 D54 D56 D58 D61 = LED0: Typical INFRARED GaAs LED; Published: 8-Jun-2000; LatestRevisionDate: 08-Jul-2005; LatestRevisionNote: Mech Layer 1 removed.; PackageReference: LED-0; Publisher: Altium Limited
D5 D12 D13 D16-D18 D23-D26 D29 D30 D33 D34 D37-D40 D48 D49 D51-D53 D55 D57 D59 D60 = SMAJ30CA: TVS DIODE 30V 48.4V DO214AC; MFR: Littelfuse Inc.; Value: SMAJ30A; Solder: SMT; MPN: SMAJ30A
F1 = Fuse 1: Fuse; Published: 8-Jun-2000; LatestRevisionDate: 17-Jul-2002; LatestRevisionNote: Re-released for DXP Platform.; PackageReference: PIN-W2/E2.8; Publisher: Altium Limited
J1 = Header 2: Header, 2-Pin; LatestRevisionDate: 17-Jul-2002; LatestRevisionNote: Re-released for DXP Platform.; Publisher: Altium Limited
J2 = UJ20-C-H-G-MSMT-4-P16-TR: MF: {'manufacturer': u'Same Sky (Formerly CUI Devices)'}; Package: None; Price: None; Value: *; MP: UJ20-C-H-G-MSMT-4-P16-TR; Availability: Unavailable
J3 = DB9_RA: Receptacle Assembly, 9 Position, Right Angle; PackageDocument: O; Positions: 9; Published: 15-Jun-2001; LatestRevisionDate: 17-Jul-2002; LatestRevisionNote: Re-released for DXP Platform.; DatasheetDocument: 1-Sep-1999; PackageReference: 788750; Publisher: Altium Limited; Orientation: Right Angle; Gender: Receptacle
J4 = Header 3: Header, 3-Pin; LatestRevisionDate: 17-Jul-2002; LatestRevisionNote: Re-released for DXP Platform.; Publisher: Altium Limited
J5 = HR911105A: Hanrun HR911105A RJ-45 Connector; Solder: WAVE; MPN: HR911105A; MFR: HanRun; Value: HR911105A
J7 = Con10: Connector 10; Value: Connector 10
L1 L2 = Inductor: Code_IEC: 1005; Published: 8-Jun-2000; LatestRevisionDate: 29-May-2009; LatestRevisionNote: IPC-7351 Footprint Added.; PackageReference: 0402-A; Publisher: Altium Limited; PackageDescription: Chip Inductor; Code_JEITA: 0402
Q1 = IRF9540: HEXFET P-Channel Power MOSFET; Note: Pin 2 is electrically connected to pin 4.; Published: 8-Jun-2000; LatestRevisionDate: 17-Jul-2002; LatestRevisionNote: Re-released for DXP Platform.; DatasheetVersion: PD-9.421C; PackageVersion: Feb-1997; PackageReference: TO-220AB; Publisher: Altium Limited; PackageDescription: TO, Thru-Hole, Vertical, Heatsink Mounted; 3 In-Line Leads; Pitch 2.54 mm; ComponentLink1Description: Manufacturer Link; ComponentLink1URL: http://www.irf.com/; ComponentLink2Description: Datasheet; ComponentLink2URL: http://www.irf.com/product-info/datasheets/data/irf9540.pdf
Q2-Q9 = C1815 HF SMD: NPN transistor; Value: C9014
R1-R7 R10-R67 RN1-1-RN1-6 RN2-1-RN2-6 RN3-1-RN3-6 RN4-1-RN4-6 RN5-1-RN5-4 RN6-1-RN6-4 RN7-1-RN7-4 RN8-1-RN8-4 = Res1: Resistor; Published: 8-Jun-2000; LatestRevisionDate: 17-Jul-2002; LatestRevisionNote: Re-released for DXP Platform.; PackageReference: AXIAL-0.3; Publisher: Altium Limited
SW1 SW2 = SW-SMD: Switch; Published: 24-Mar-1999; LatestRevisionDate: 17-Jul-2002; LatestRevisionNote: Re-released for DXP Platform.; PackageReference: SPST-2; Publisher: Altium Limited
U1 = LM2576HVT-5.0: SIMPLE SWITCHER; 3A Step-Down Voltage Regulator; Manufacturer: National Semiconductor; PackageTopMarking: NSUZXYTT*LM2576HVT*-5.0 P+; PowerWise: N; FirstPublished: 4-Dec-2008; DatasheetVersion: Aug-2004; PackageVersion: revJ, Jan-1992; PackageReference: T05A; Publisher: Altium Limited; PackageDescription: TO-220, Molded, 5 Lead, Straight; CompType: Switcher; PartNumber: LM2576HVT-5.0; RoHS: O; PinCount: 5; DigiKeyPartNumber: LM2576HVT-5.0-ND; Code_JEDEC: TO-220-AB; ComponentLink1Description: LM2576HV Datasheet; ComponentLink1URL: http://www.national.com/ds/LM/LM2576HV.pdf; ComponentLink2Description: LM2576HV Web Page; ComponentLink2URL: http://www.national.com/pf/LM/LM2576HV.html; ComponentLink3Description: T05A Package Page; ComponentLink3URL: http://www.national.com/packaging/folders/t05a.html
U2 = USBLC6-2P6: ESD Protection for USB 2.0 High Speed; Manufacturer_Name: STMicroelectronics; Copyright: Copyright (C) 2025 Ultra Librarian. All rights reserved.; Manufacturer_Part_Number: USBLC6-2P6; RefDes: RefDes; Type: Type
U3 = MP1584EN-LF-Z: <p>3A 1.5MHz 28V Step-Down Converter</p>; Manufacturer_Name: Monolithic Power Systems; Copyright: Copyright (C) 2026 Ultra Librarian. All rights reserved.; Manufacturer_Part_Number: MP1584EN-LF-Z; RefDes: RefDes; Type: Type
U4 = LTC4412ES6TRMPBF: Low Loss PowerPathâ„¢ Controller in ThinSOT; Manufacturer_Name: Analog Devices Inc; Copyright: Copyright (C) 2025 Ultra Librarian. All rights reserved.; Manufacturer_Part_Number: LTC4412ES6#TRMPBF; RefDes: RefDes; Type: Type
U5 U9 = B0505S: Cắm; Ten_Linh_Kien: B0505S-1W SIP4 IC Converter DC-DC; Don_Vi: Con; Ma_Hang: MH003143; Ghi_Chu: *; Kieu_Chan: *; Chung_Loai: Cắm
U6 U8 U11-U13 = IC_HCPL-3120-500E: 2.5A Gate Driver Optical Coupling 3750Vrms 1 Channel 8-DIP Gull Wing; Manufacturer: Broadcom Avago; Alternate Part Number-1: NA; Manufacturer Part Number: HCPL-3120-500E; Case/Package: SOIC8; Supplier-1: MOUSER; Supplier Part Number-1: HCPL-3120-500E
U7 = SP232: Enhanced RS-232 Line Drivers/Receivers; Manufacturer: Sipex; Vendor: Digikey; Volt: 5V; Data Rate (Max): 120kbps; Published: 13-April-2009; Publisher: Hoang Nguyen; ComponentLink1Description: Digikey Part Link; ComponentLink2Description: Open Datasheet; ComponentLink2URL: H:\LIBRARY\LIBRARY.Datasheet\
U10 = MAX485: RS232 - RS485 (Same sn75176)
U14 = ch9121t_c45354919: Type:Ethernet Transceiver Number of ports: Ethernet Speed Standards:10BASE-T；100BASE-TX Data Rate:100Mbit/s；10Mbit/s Voltage - Supply:3.2V~3.4V Voltage - Supply:3.2V~3.4V Operating Temperature:-40℃~+85℃ Operating Temperature:-40℃~+85℃ Features:Programmabl; Manufacturer: WCH(南京沁恒); AddInBom: yes; ModelId: d00c537554e8428abe371c2c4fe2166f; ModelName: TSSOP-20_L6.5-W4.4-H1.0-LS6.4-P0.65; ModelTransform: 251.969,255.906,0,90,0,0,0.0005,0,0; Symbol: CH9121T_C45354919; LCSC Part Name: 网络串口透传芯片; SupplierPart: C45354919; ManufacturerPart: CH9121T; Supplier Footprint: TSSOP-20; JLCPCB Part Class: Extended Part; Datasheet: https://item.szlcsc.com/datasheet/CH9121T/47444202.html; Supplier: LCSC; ConvertToPcb: yes; FootprintName: TSSOP-20_L6.5-W4.4-P0.65-LS6.4-BL; Type: Ethernet Transceiver; Ethernet Speed Standards: 10BASE-T；100BASE-TX; Data Rate: 100Mbit/s；10Mbit/s; Voltage - Supply: 3.2V~3.4V; Operating Temperature: -40℃~+85℃; Features: Programmable LED indication；Power-on reset
U15 = ESP32-S3-WROOM-1: Description; Manufacturer_Name: Espressif Systems; Type: Transceiver module; Copyright: Copyright (C) 2026 Ultra Librarian. All rights reserved.; Manufacturer_Part_Number: ESP32-S3-WROOM-1-N8; RefDes: RefDes
U16-U21 = PC817 x 4: PC817 OPTO
Y1 = XTAL: Crystal Oscillator; Published: 8-Jun-2000; LatestRevisionDate: 17-Jul-2002; LatestRevisionNote: Re-released for DXP Platform.; PackageReference: R38; Publisher: Altium Limited